# Altium project ActuatorMKII.PrjPcb
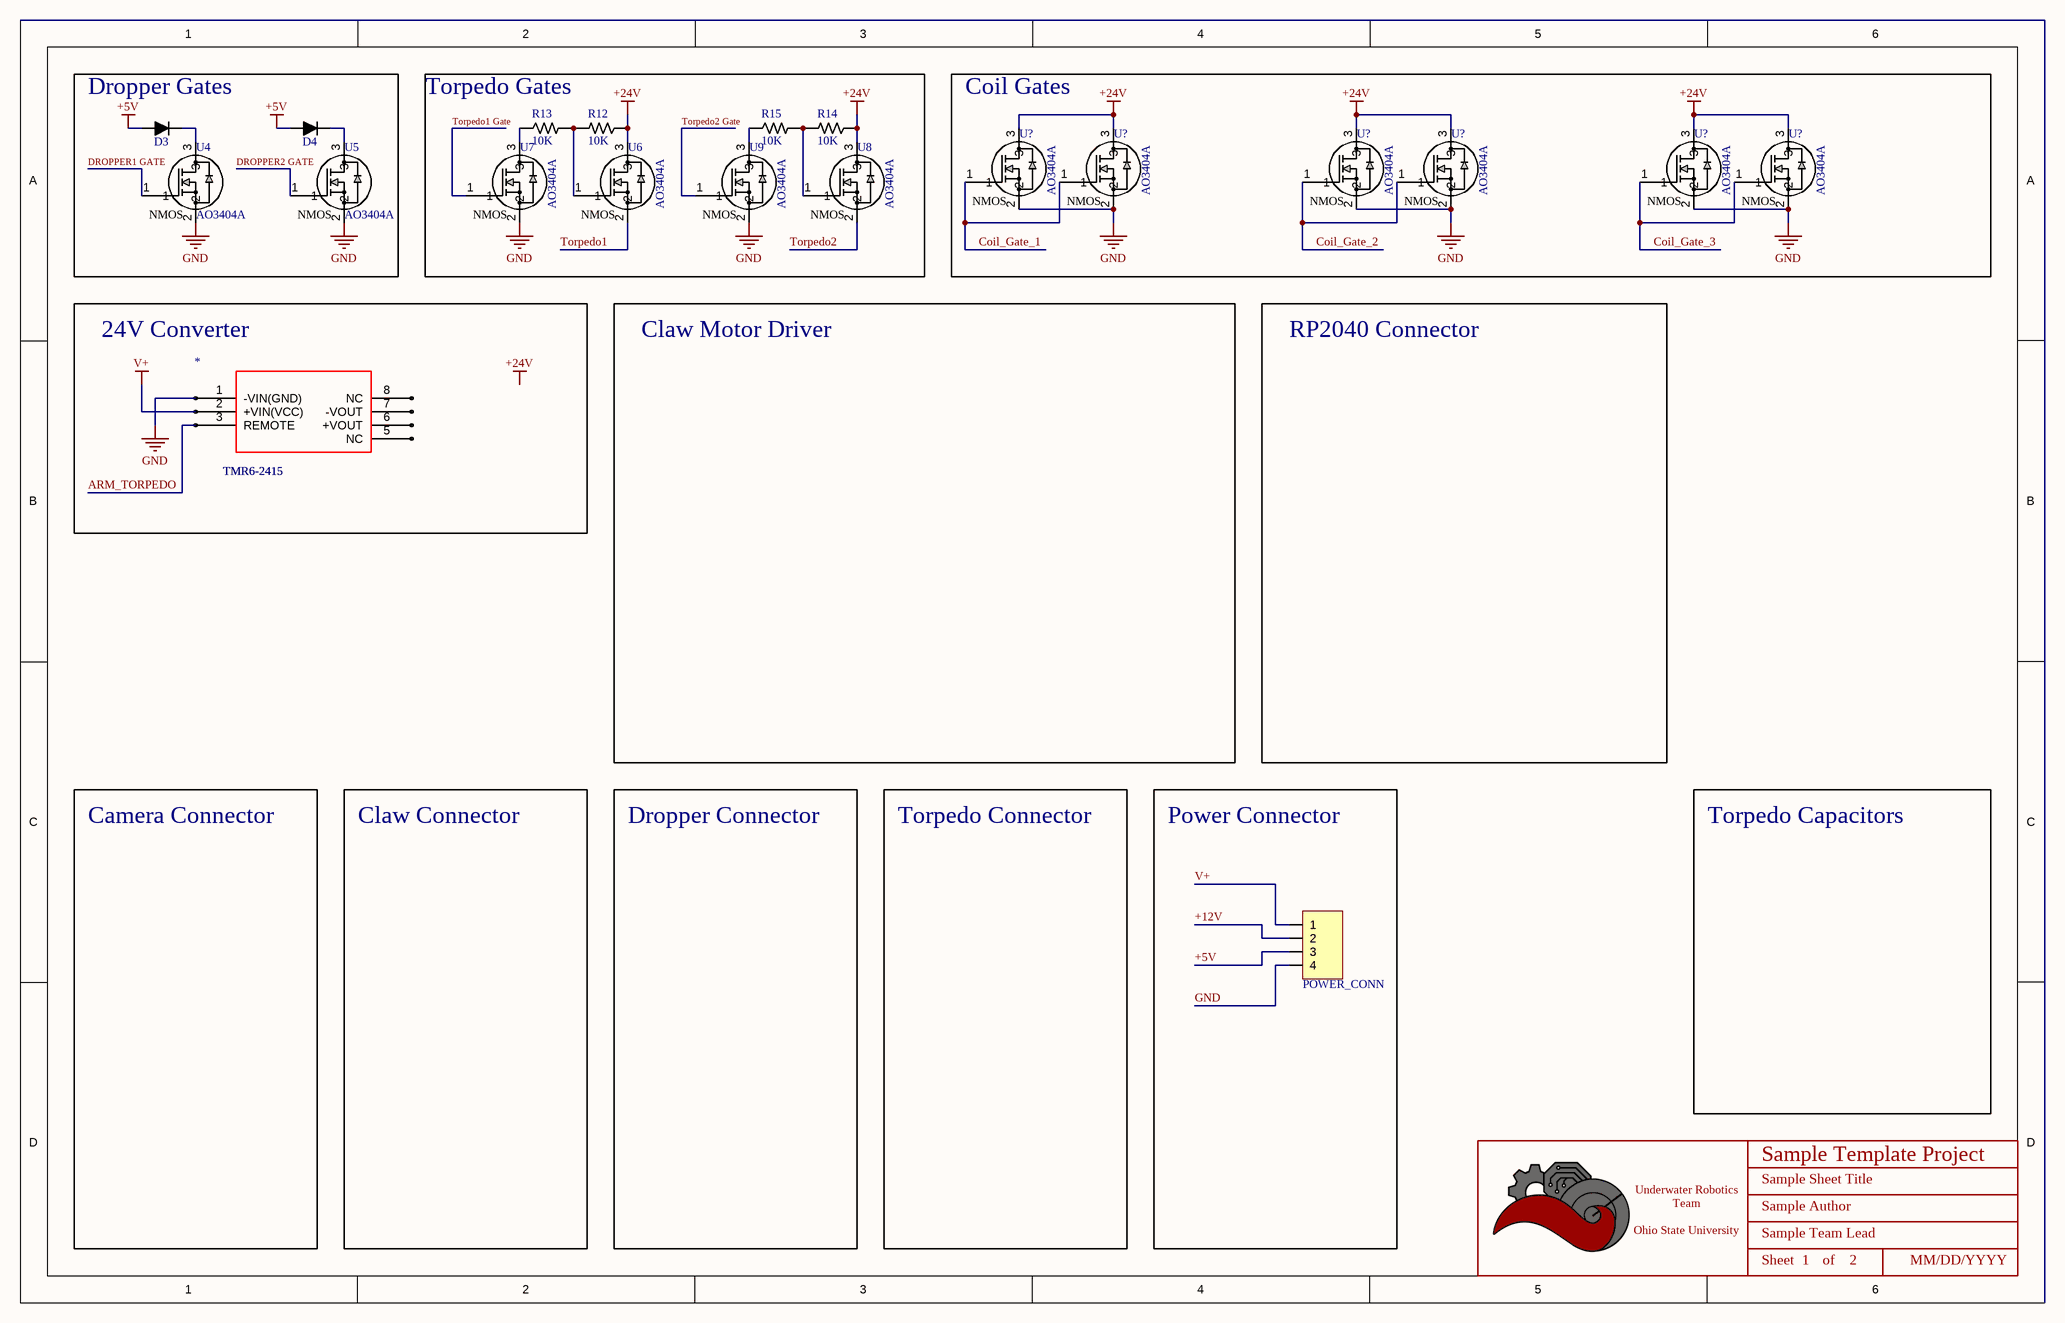
[diagram p0: ActuatorMKII_Sheet1.SchDoc]
BoardRevision: 1.0; DateOfDesignReview: XX/XX/XXXX; ProjectTitle: Sample Template Project; TeamLead: Sample Team Lead
2 sheets, 22 parts. Net scope: global (net labels, ports and power ports of the same name join across sheets).
Sheets:
  ActuatorMKII_Sheet1.SchDoc
  Sch_Notes_Template.SchDoc

## Sheet ActuatorMKII_Sheet1.SchDoc: Sample Sheet Title
size B; Date: MM/DD/YYYY; Author: Sample Author; Organization: ORGANIZATION; Address1: ADDRESS 1; Address2: ADDRESS 2; Address3: ADDRESS 3; Address4: ADDRESS 4; Revision: -; SheetNumber: 1; SheetTotal: 2; ENG_APP_DATE: --/--/--; DSN_APP_DATE: --/--/--; CHK_APP_DATE: --/--/--

### Parts
(Parts that share a designator on the sheet are numbered #1, #2 ... from top to bottom, then left to right.)
*#1  TMR6-2415
*#2  Title_Block  [LOGO]  (value not drawn)  (graphical)
D3  MBR0520LT3G  [SOD-123]  (value not drawn)
D4  MBR0520LT3G  [SOD-123]  (value not drawn)
POWER_CONN  4 POS R/A  [CONN_MOLEX_MINIFIT JR_4 POS_R/A]  (value not drawn)
R12  Value  (Ohms): 10K  [RESISTOR_0603]  (hidden comment: 10k Ohm 5% 1/10W)
R13  Value  (Ohms): 10K  [RESISTOR_0603]  (hidden comment: 10k Ohm 5% 1/10W)
R14  Value  (Ohms): 10K  [RESISTOR_0603]  (hidden comment: 10k Ohm 5% 1/10W)
R15  Value  (Ohms): 10K  [RESISTOR_0603]  (hidden comment: 10k Ohm 5% 1/10W)
U4  AO3404A  [SOT-23-3]
U5  AO3404A  [SOT-23-3]
U6  AO3404A  [SOT-23-3]
U7  AO3404A  [SOT-23-3]
U8  AO3404A  [SOT-23-3]
U9  AO3404A  [SOT-23-3]
U?#1  AO3404A  [SOT-23-3]
U?#2  AO3404A  [SOT-23-3]
U?#3  AO3404A  [SOT-23-3]
U?#4  AO3404A  [SOT-23-3]
U?#5  AO3404A  [SOT-23-3]
U?#6  AO3404A  [SOT-23-3]

### Blocks framed on the sheet
Dropper Gates: D3 D4 U4 U5
Torpedo Gates: R12-R15 U6-U9
Coil Gates: U?#1-U?#6
24V Converter: *#1
Power Connector: POWER_CONN

### Nets
+5V: D3.1 D4.1 POWER_CONN.3
+24V: R12.2 R14.2 U6.3 U8.3 U?#1.3 U?#2.3 U?#3.3 U?#4.3 U?#5.3 U?#6.3
GND: *#1.1(-VIN(GND)) POWER_CONN.4 U4.2 U5.2 U7.2 U9.2 U?#1.2 U?#2.2 U?#3.2 U?#4.2 U?#5.2 U?#6.2
V+: *#1.2(+VIN(VCC)) POWER_CONN.1
+12V: POWER_CONN.2
ARM_TORPEDO: *#1.3(REMOTE)
Coil_Gate_1: U?#1.1 U?#2.1
Coil_Gate_2: U?#3.1 U?#4.1
Coil_Gate_3: U?#5.1 U?#6.1
DROPPER1 GATE: U4.1
DROPPER2 GATE: U5.1
Torpedo1: U6.2
Torpedo1 Gate: U7.1
Torpedo2: U8.2
Torpedo2 Gate: U9.1
NetD3_2: D3.2 U4.3
NetD4_2: D4.2 U5.3
NetR12_1: R12.1 R13.1 U6.1
NetR13_2: R13.2 U7.3
NetR14_1: R14.1 R15.1 U8.1
NetR15_2: R15.2 U9.3

Not connected (* = marked no-connect by the designer): *#1 5(NC) 6(+VOUT) 7(-VOUT) 8(NC)

### Notes on the sheet
- Claw Motor Driver
- RP2040 Connector
- Camera Connector
- Claw Connector
- Dropper Connector
- Torpedo Connector
- Torpedo Capacitors
- Labels drawn without touching a wire or pin: +24V
- DWG. NO.
- REV.
- SHT.
- THIS DOCUMENT AND THE DATA DISCLOSED HEREIN OR HEREWITH IS THE PROPERTY OF ALTIUM LIMITED AND MAY BE FREELY DISTRIBUTED IN WHOLE. NO RIGHTS ARE RESERVED OR EXPRESS OR IMPLIED WARANTEE GIVEN.
- REVISION
- DESCRIPTION
- DATE
- APPROVED
- ENG:
- APPROVALS
- PROJECT
- DSN:
- CHK:
- REFERENCE DOCUMENTS
- PROJECT REVISION:
- TITLE
- DOCUMENT REVISION:
- DESIGN ITEM:
- BOM:
- FAB DWG:
- PCB DWG:
- ASSY DWG:
- SCALE:
- SIZE
- B
- CAGE CODE
- FILE NAME
- DWG NO.
- SHEET
- OF
- REV
- (in symbol AO3404A) NMOS
- (in symbol Title_Block) Underwater Robotics Team / Ohio State University; Sheet; of

### Library data of the parts
*#1 = TMR6-2415: 24v dc dc converter 18-36v 250mA; Vnom: 24V DC; created by: vasili; verified by: someone; Supplier 1: Digi-Key; Supplier Part Number 1: 1951-1797-ND; max current: 250mA
*#2 = Title_Block: UWRT Schematic Title Block Template / Created June 2021, Dylan Trainor
D3 D4 = SCHOTTKY_20V_500mA: Schottky Diode, 20V reverse breakdown, 500mA, Vf = 0.385V; Made By: Flip B; ComponentLink1Description: Datasheet; ComponentLink1URL: https://www.onsemi.com/pdf/datasheet/mbr0520lt1-d.pdf; Forward Voltage: 0.385V; Forward Current: 500mA; Package: SOD-123; Supplier 1: Digi-Key; Supplier Part Number 1: MBR0520LT3GOSCT-ND
POWER_CONN = CONN_MOLEX_MINIFIT JR_4POS_R/A: Molex Minifit Jr. 5569 / 4 Pos R/A Natural; Pitch: 4.2mm; Configuration: Right Angle; Current Per Pin: 13A; Number of Positions: 4; Supplier Part Number 1: WM13112-ND; Supplier 1: Digi-Key; Manufacturer: Molex; Color: Natural; Created By: Flip B; ComponentLink1Description: Datasheet; ComponentLink1URL: https://www.molex.com/pdm_docs/sd/026013115_sd.pdf; Series: Minifit Jr 5569
R12-R15 = RESISTOR_10K_0603: RES 10k OHM 5% 1/10W 0603; Tolerance: +/- 5%; Wattage: 1/8W; Made By: Robert Pafford; ComponentLink1Description: Datasheet; ComponentLink1URL: https://www.bourns.com/docs/product-datasheets/CRxxxxx.pdf; Supplier: Digikey; Digikey Part Numer: CR0603-JW-104ELFTR-ND; Supplier 1: Digi-Key; Supplier Part Number 1: 2019-RK73B1JTTD103JCT-ND
U4-U9 U?#1-U?#6 = AO3404A: N-Channel 30 V 5.8A (Ta) 1.4W (Ta) Surface Mount SOT-23-3; Vendor: Alpha & Omega Semiconductor Inc.; SourceLibrary: ON_Semiconductor_2020-01-13; Vgs (Max): 3V @ 5.8A, 10V; Vgs (th): 3V @ 250µA; Vdss: 30V; Rds (on): 28mOhm @ 5.8A, 10V; Amp Rating: 5.8 A; FET Type: N-Channel; Package: SOT23-3L; Manufacturer _Part_Number: AO3404A; Power Dissipation: 1.4W (Ta); Supplier 1: Digi-Key; Supplier Part Number 1: 785-1004-1-ND; Created By: Dylan T

## Sheet Sch_Notes_Template.SchDoc: Design Notes
size B; Date: MM/DD/YYYY; Author: Sample Author; Organization: ORGANIZATION; Address1: ADDRESS 1; Address2: ADDRESS 2; Address3: ADDRESS 3; Address4: ADDRESS 4; Revision: -; SheetNumber: 2; SheetTotal: 2; ENG_APP_DATE: --/--/--; DSN_APP_DATE: --/--/--; CHK_APP_DATE: --/--/--
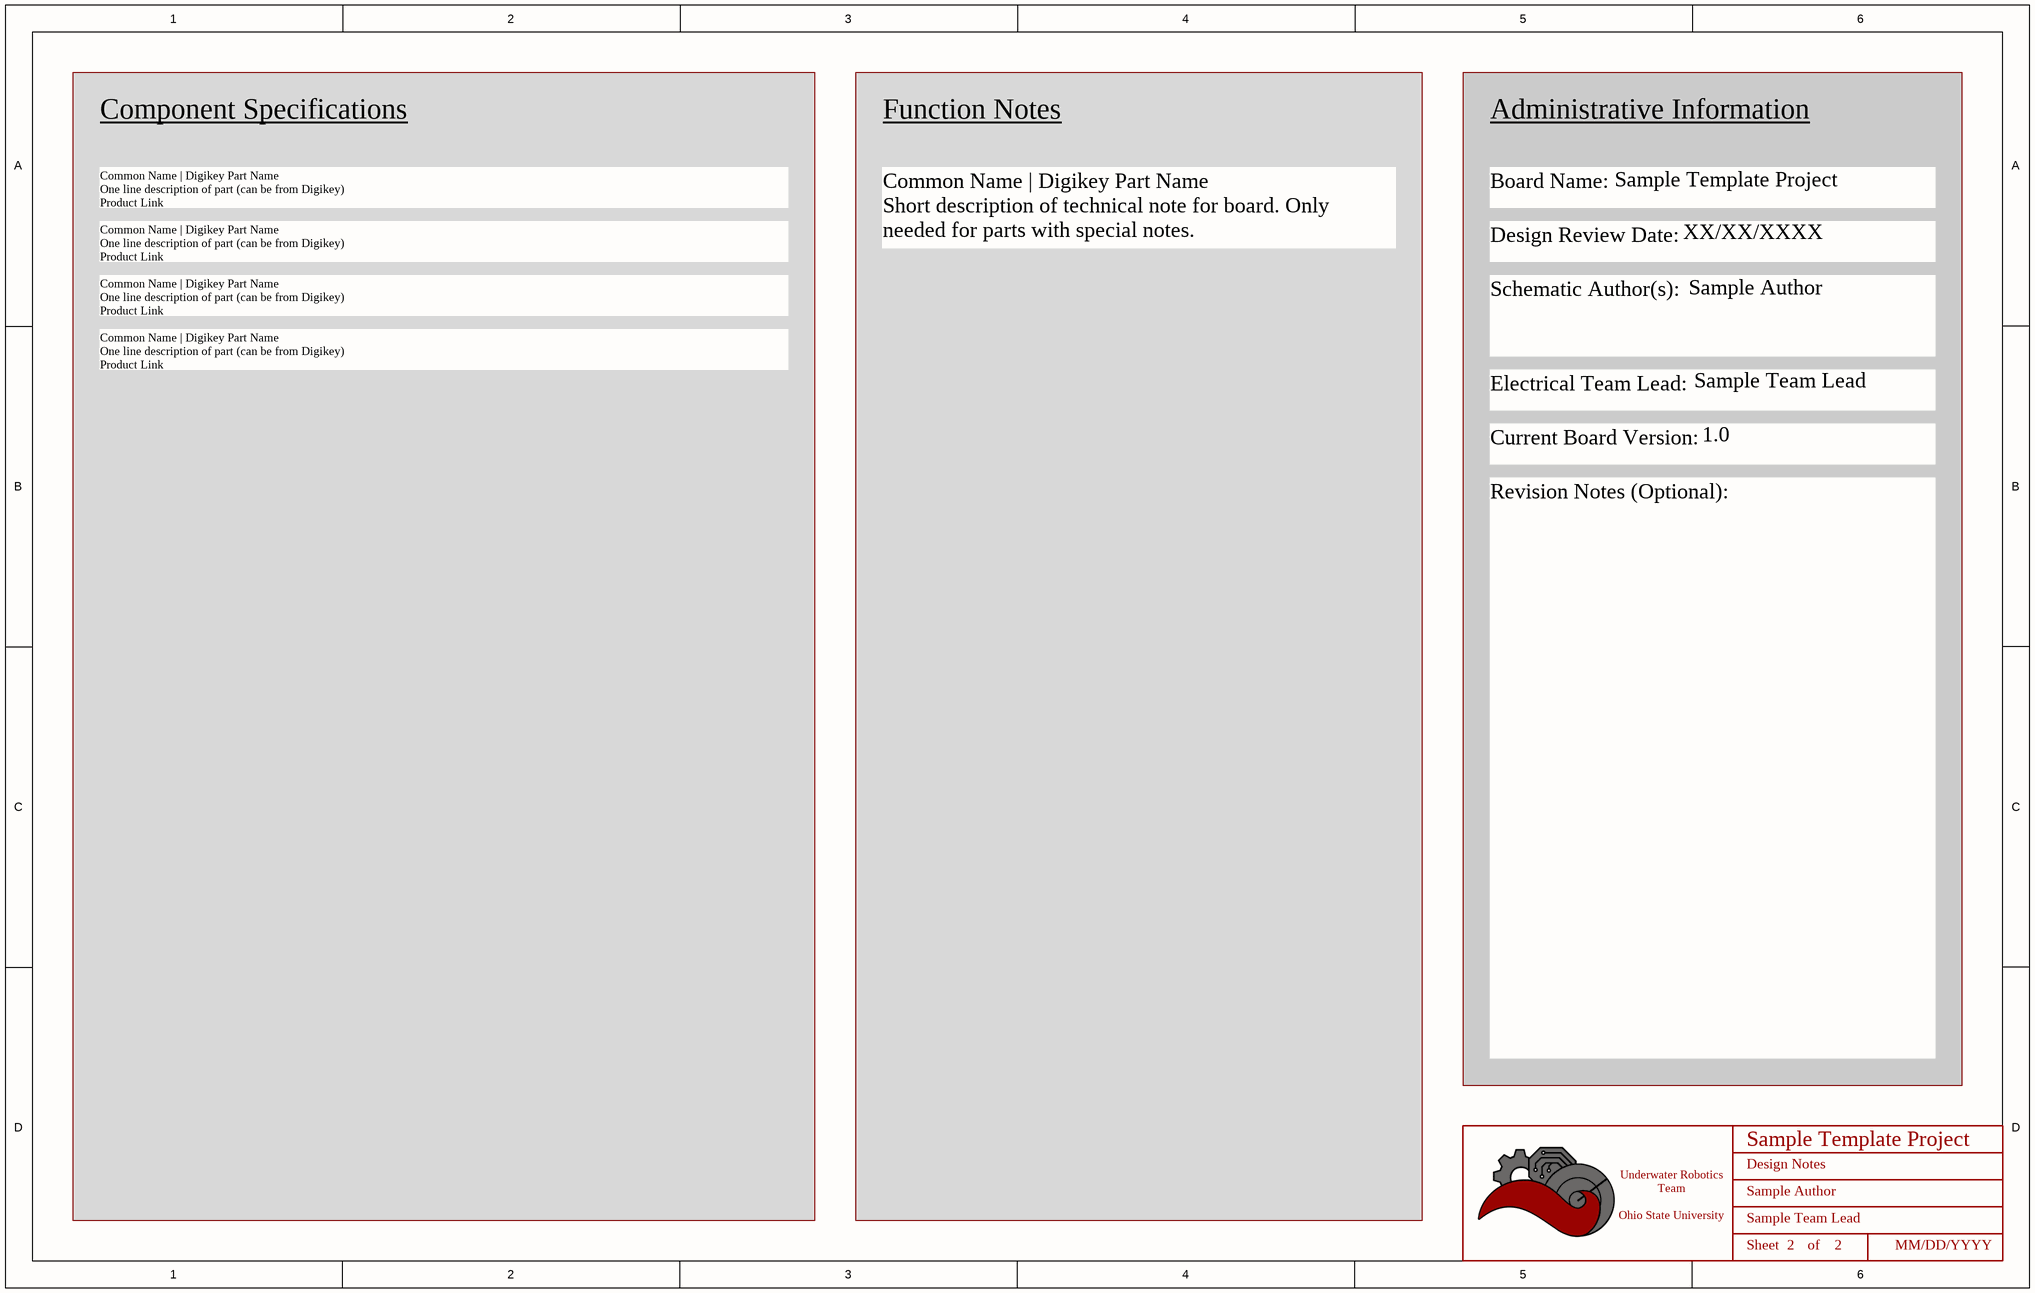
[diagram p1: Sch_Notes_Template.SchDoc]

### Parts
(Parts that share a designator on the sheet are numbered #1, #2 ... from top to bottom, then left to right.)
*#3  Title_Block  [LOGO]  (value not drawn)  (graphical)

### Notes on the sheet
- Component Specifications
- Function Notes
- Administrative Information
- Common Name | Digikey Part Name
  One line description of part (can be from Digikey)
  Product Link
- Board Name:
- Common Name | Digikey Part Name
  Short description of technical note for board. Only needed for parts with special notes.
- Design Review Date:
- Schematic Author(s):
- Electrical Team Lead:
- Current Board Version:
- Revision Notes (Optional):
- DWG. NO.
- REV.
- SHT.
- THIS DOCUMENT AND THE DATA DISCLOSED HEREIN OR HEREWITH IS THE PROPERTY OF ALTIUM LIMITED AND MAY BE FREELY DISTRIBUTED IN WHOLE. NO RIGHTS ARE RESERVED OR EXPRESS OR IMPLIED WARANTEE GIVEN.
- REVISION
- DESCRIPTION
- DATE
- APPROVED
- ENG:
- APPROVALS
- PROJECT
- DSN:
- CHK:
- REFERENCE DOCUMENTS
- PROJECT REVISION:
- TITLE
- DOCUMENT REVISION:
- DESIGN ITEM:
- BOM:
- FAB DWG:
- PCB DWG:
- ASSY DWG:
- SCALE:
- SIZE
- B
- CAGE CODE
- FILE NAME
- DWG NO.
- SHEET
- OF
- REV
- (in symbol Title_Block) Underwater Robotics Team / Ohio State University; Sheet; of

### Library data of the parts
*#3 = Title_Block: as *#2 on sheet ActuatorMKII_Sheet1